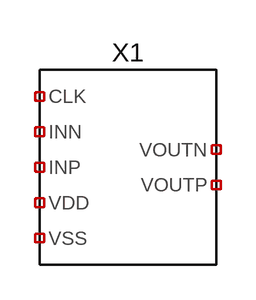
[diagram p0: schematic Draft4.asc]
Draft4.asc, the LTspice schematic file:
Version 4
SHEET 1 880 680
SYMBOL my_comparator_new 256 208 R0
SYMATTR InstName X1

The netlist it stands for:
* Draft4.asc
XX1 NC_01 NC_02 NC_03 NC_04 NC_05 NC_06 NC_07 my_comparator_new  ; pins CLK INN INP VDD VSS VOUTN VOUTP
.backanno
.end